# Altium project led_7seg_big.PrjPcb
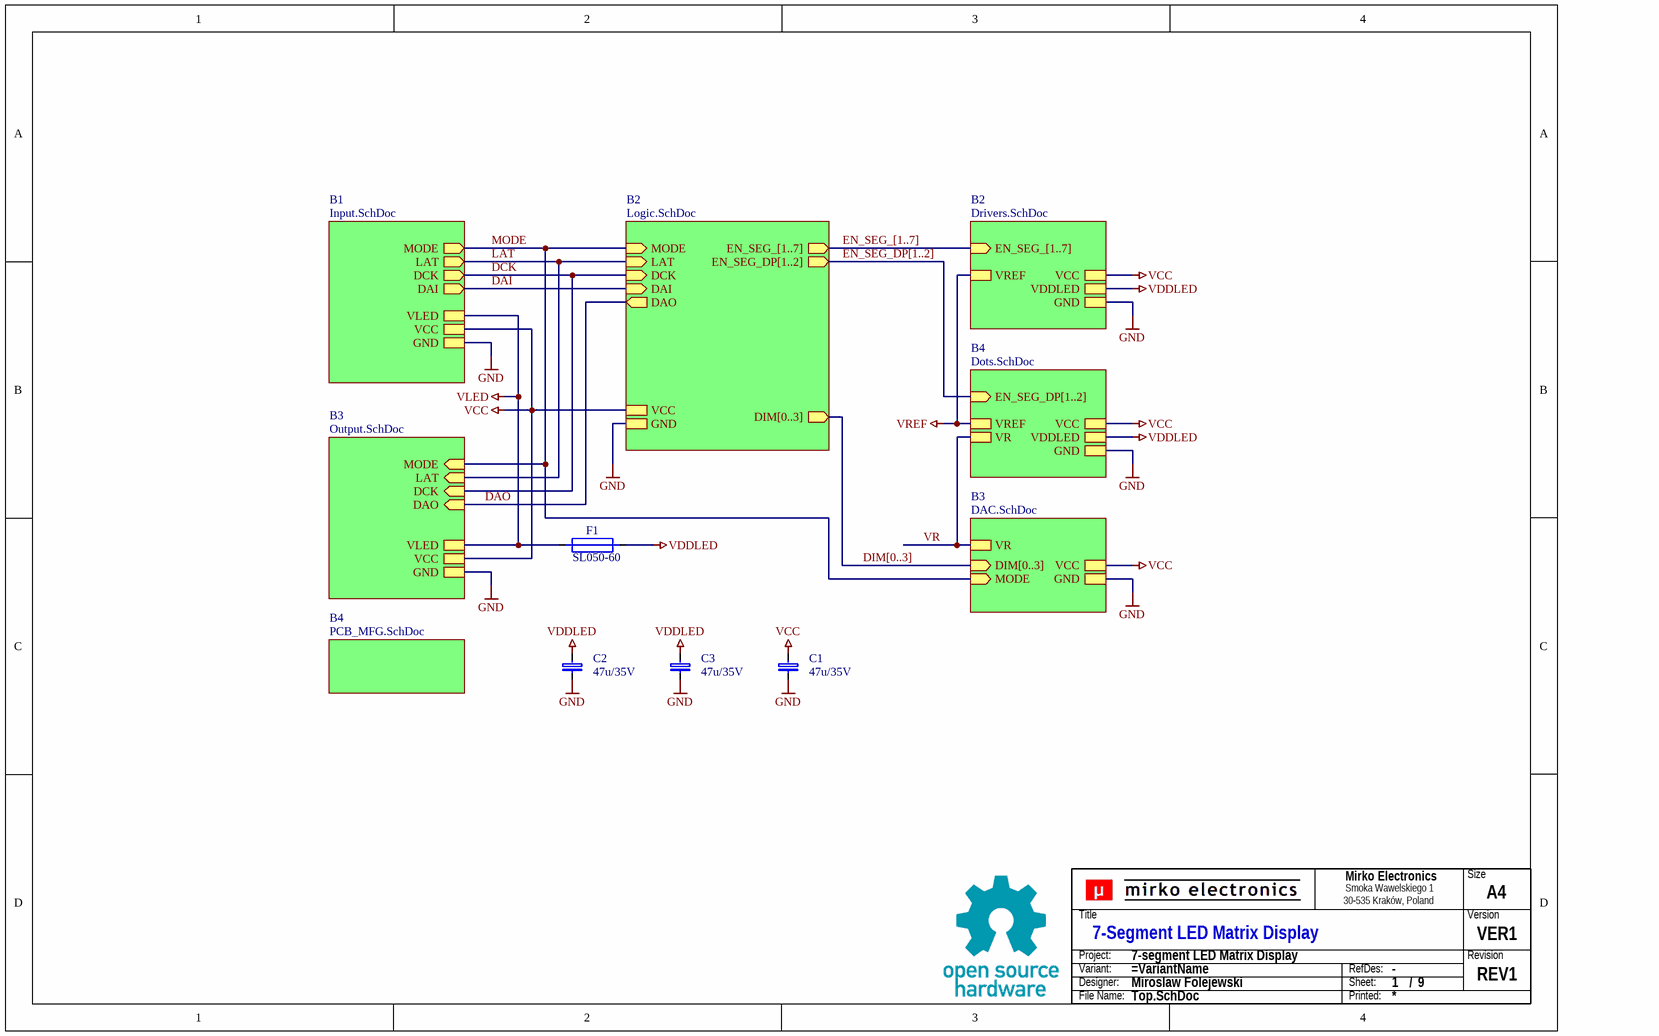
[diagram p0: Top.SchDoc]
PCBProjectName: 7-segment LED Matrix Display; SchPcbRevision: REV1; SchPcbVersion: VER1
9 sheets, 236 parts. Net scope: hierarchical (ports join the sheet entries above them; power ports are global).
Board files: led_7seg_big.PcbDoc, construction.PcbDoc
Sheets:
  Top.SchDoc
    B1 = Input.SchDoc
    B2 = Logic.SchDoc
    B3 = Output.SchDoc
    B4 = PCB_MFG.SchDoc
    B2 = Drivers.SchDoc
      seg1 = Row.SchDoc
      seg2 = Row.SchDoc
      seg3 = Row.SchDoc
      seg4 = Row.SchDoc
      seg5 = Row.SchDoc
      seg6 = Row.SchDoc
      seg7 = Row.SchDoc
    B3 = DAC.SchDoc
    B4 = Dots.SchDoc
      seg9 = Row.SchDoc

## Sheet Top.SchDoc: 7-Segment LED Matrix Display
size A4; Address1: Smoka Wawelskiego 1; Address2: 30-535 Kraków, Poland; DocumentNumber: 1; Revision: v01; SheetNumber: 1; SheetTotal: 9; Author: Miroslaw Folejewski; CompanyName: Mirko Electronics; DrawnBy: Miroslaw Folejewski; Engineer: Miroslaw Folejewski; PageSetup: Record=PageOptions|CenterHorizontal=True|CenterVertical=True|PrintScale=1.00|XCorrection=1.00|YCorrection=1.00|PrintKind=0|BorderSize=5000000|LeftOffset=0|BottomOffset=0|Orientation=2|PaperLength=1000|PaperWidth=1000|Scale=100|PaperSource=7|PrintQuality=-4|MediaType=1|DitherType=10|PaperKind=A4|PrintScaleMode=1; PageSize: A4; Designators: -; ProjectName: 7-Segment LED Matrix Display

### Parts
(Parts that share a designator on the sheet are numbered #1, #2 ... from top to bottom, then left to right.)
?#1  (no value)  (graphical)
C1  47u/35V  [CAP_V_6.3X11]
C2  47u/35V  [CAP_V_6.3X11]
C3  47u/35V  [CAP_V_6.3X11]
F1  SL050-60  [2920]
TB?#1  Title block  (value not drawn)  (graphical)

### Sub-sheets
B1 = Input.SchDoc: MODE (out), LAT (out), DCK (out), DAI (out), VCC, VLED, GND
B2 = Logic.SchDoc: MODE (in), LAT (in), DCK (in), DAI (in), VCC, GND, DAO (out), EN_SEG_[1..7] (out), EN_SEG_DP[1..2] (out), DIM[0..3] (out)
B2 = Drivers.SchDoc: EN_SEG_[1..7] (in), VCC, VDDLED, GND, VREF
B3 = Output.SchDoc: MODE (in), LAT (in), DCK (in), VCC, VLED, GND, DAO (in)
B3 = DAC.SchDoc: DIM[0..3] (in), VCC, MODE (in), GND, VR
B4 = PCB_MFG.SchDoc: no entries
B4 = Dots.SchDoc: EN_SEG_DP[1..2] (in), VCC, VDDLED, GND, VREF, VR

### Nets
GND: C1.1 C2.1 C3.1 ; sheet B1/GND, sheet B2/GND, sheet B3/GND, sheet B2/GND, sheet B3/GND, sheet B4/GND
VCC: C1.2 ; sheet B1/VCC, sheet B2/VCC, sheet B3/VCC, sheet B2/VCC, sheet B3/VCC, sheet B4/VCC
VDDLED: C2.2 C3.2 F1.1 ; sheet B2/VDDLED, sheet B4/VDDLED
VLED: F1.2 ; sheet B1/VLED, sheet B3/VLED
VREF: sheet B2/VREF, sheet B4/VREF
DAI: sheet B1/DAI, sheet B2/DAI
DAO: sheet B2/DAO, sheet B3/DAO
DCK: sheet B1/DCK, sheet B2/DCK, sheet B3/DCK
LAT: sheet B1/LAT, sheet B2/LAT, sheet B3/LAT
MODE: sheet B1/MODE, sheet B2/MODE, sheet B3/MODE, sheet B3/MODE
VR: sheet B3/VR, sheet B4/VR

### Buses and harness runs
bus DIM[0..3] = sheet B2/DIM[0..3] = sheet B3/DIM[0..3]
bus EN_SEG_[1..7] = sheet B2/EN_SEG_[1..7]
bus EN_SEG_DP[1..2] = sheet B2/EN_SEG_DP[1..2] = sheet B4/EN_SEG_DP[1..2]

### Notes on the sheet
- Title
- Size
- Revision
- Checked By:
- Project:
- Variant:
- Engineer:
- Date:
- Sheet:
- /
- Designators
- Approved By:
- File:
- (in symbol SCH_TITLE_BLOCK_V1) Size; Title; Version; Project:; Revision; Variant:; RefDes:; Designer:; Sheet:; /; File Name:; Printed:

### Library data of the parts
?#1 = Title Block NeoStrain
C1-C3 = CAP_EL_SMD: Kondensator elektrolityczny 2.5x6.3x11
F1 = FUSE
TB?#1 = SCH_TITLE_BLOCK_V1: Component Type: Title block; Manufacturer: -; Mounting Type: Non component; MPN: -; Operating Temperature: -; Package: -; Specification: Title block; Value: Title block; Replacement: -; System: ?

## Sheet Input.SchDoc: Input
size A4; Address1: Smoka Wawelskiego 1; Address2: 30-535 Kraków, Poland; DocumentNumber: 2; Revision: v01; SheetNumber: 2; SheetTotal: 9; Author: Miroslaw Folejewski; CompanyName: Mirko Electronics; DrawnBy: Miroslaw Folejewski; Engineer: Miroslaw Folejewski; PageSetup: Record=PageOptions|CenterHorizontal=True|CenterVertical=True|PrintScale=1.00|XCorrection=1.00|YCorrection=1.00|PrintKind=0|BorderSize=5000000|LeftOffset=0|BottomOffset=0|Orientation=2|PaperLength=1000|PaperWidth=1000|Scale=100|PaperSource=7|PrintQuality=-4|MediaType=1|DitherType=10|PaperKind=A4|PrintScaleMode=1; PageSize: A4; Designators: -; ProjectName: 7-Segment LED Matrix Display
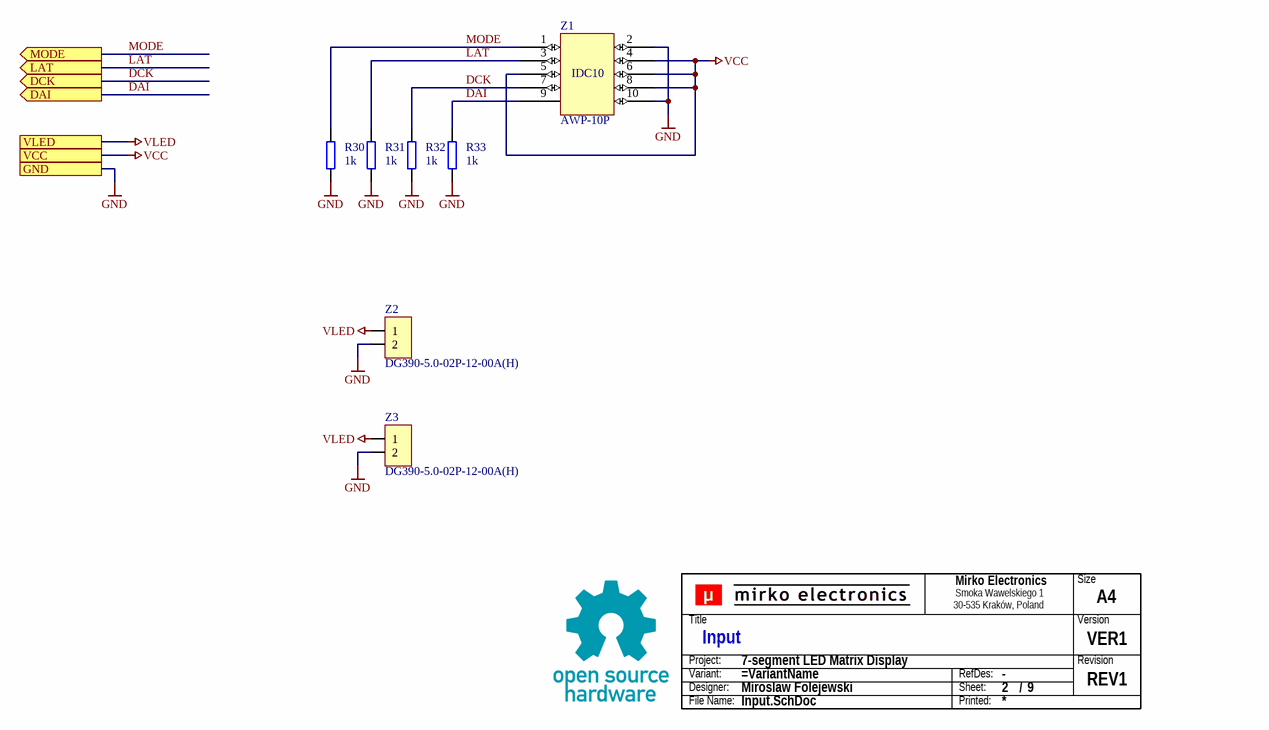
[diagram p1: Input.SchDoc]

### Parts
(Parts that share a designator on the sheet are numbered #1, #2 ... from top to bottom, then left to right.)
?#2  (no value)  (graphical)
R30  1k  [0805]
R31  1k  [0805]
R32  1k  [0805]
R33  1k  [0805]
TB?#2  Title block  (value not drawn)  (graphical)
Z1  AWP-10P  [BH10S]
Z2  DG390-5.0-02P-12-00A(H)  [WAGO2X2-5]
Z3  DG390-5.0-02P-12-00A(H)  [WAGO2X2-5]

### Ports
DAI (out), DCK (out), GND, LAT (out), MODE (out), VCC, VLED

### Nets
GND: R30.1 R31.1 R32.1 R33.1 Z1.2 Z1.10 Z2.2 Z3.2 ; port GND
VCC: Z1.4 Z1.5 Z1.6 Z1.8 ; port VCC
VLED: Z2.1 Z3.1 ; port VLED
DAI: R33.2 Z1.9 ; port DAI
DCK: R32.2 Z1.7 ; port DCK
LAT: R31.2 Z1.3 ; port LAT
MODE: R30.2 Z1.1 ; port MODE

### Notes on the sheet
- Title
- Size
- Revision
- Checked By:
- Project:
- Variant:
- Engineer:
- Date:
- Sheet:
- /
- Designators
- Approved By:
- File:
- (in symbol SCH_TITLE_BLOCK_V1) Size; Title; Version; Project:; Revision; Variant:; RefDes:; Designer:; Sheet:; /; File Name:; Printed:

### Library data of the parts
?#2 = Title Block NeoStrain
R30-R33 = R0805
TB?#2 = SCH_TITLE_BLOCK_V1: Component Type: Title block; Manufacturer: -; Mounting Type: Non component; MPN: -; Operating Temperature: -; Package: -; Specification: Title block; Value: Title block; Replacement: -; System: ?
Z1 = IDC10
Z2 Z3 = CON2: Connector

## Sheet Logic.SchDoc: 16-bit Register
size A4; Address1: Smoka Wawelskiego 1; Address2: 30-535 Kraków, Poland; DocumentNumber: 4; Revision: v01; SheetNumber: 4; SheetTotal: 9; Author: Miroslaw Folejewski; CompanyName: Mirko Electronics; DrawnBy: Miroslaw Folejewski; Engineer: Miroslaw Folejewski; PageSetup: Record=PageOptions|CenterHorizontal=True|CenterVertical=True|PrintScale=1.00|XCorrection=1.00|YCorrection=1.00|PrintKind=0|BorderSize=5000000|LeftOffset=0|BottomOffset=0|Orientation=2|PaperLength=1000|PaperWidth=1000|Scale=100|PaperSource=7|PrintQuality=-4|MediaType=1|DitherType=10|PaperKind=A4|PrintScaleMode=1; PageSize: A4; Designators: -; ProjectName: 7-Segment LED Matrix Display
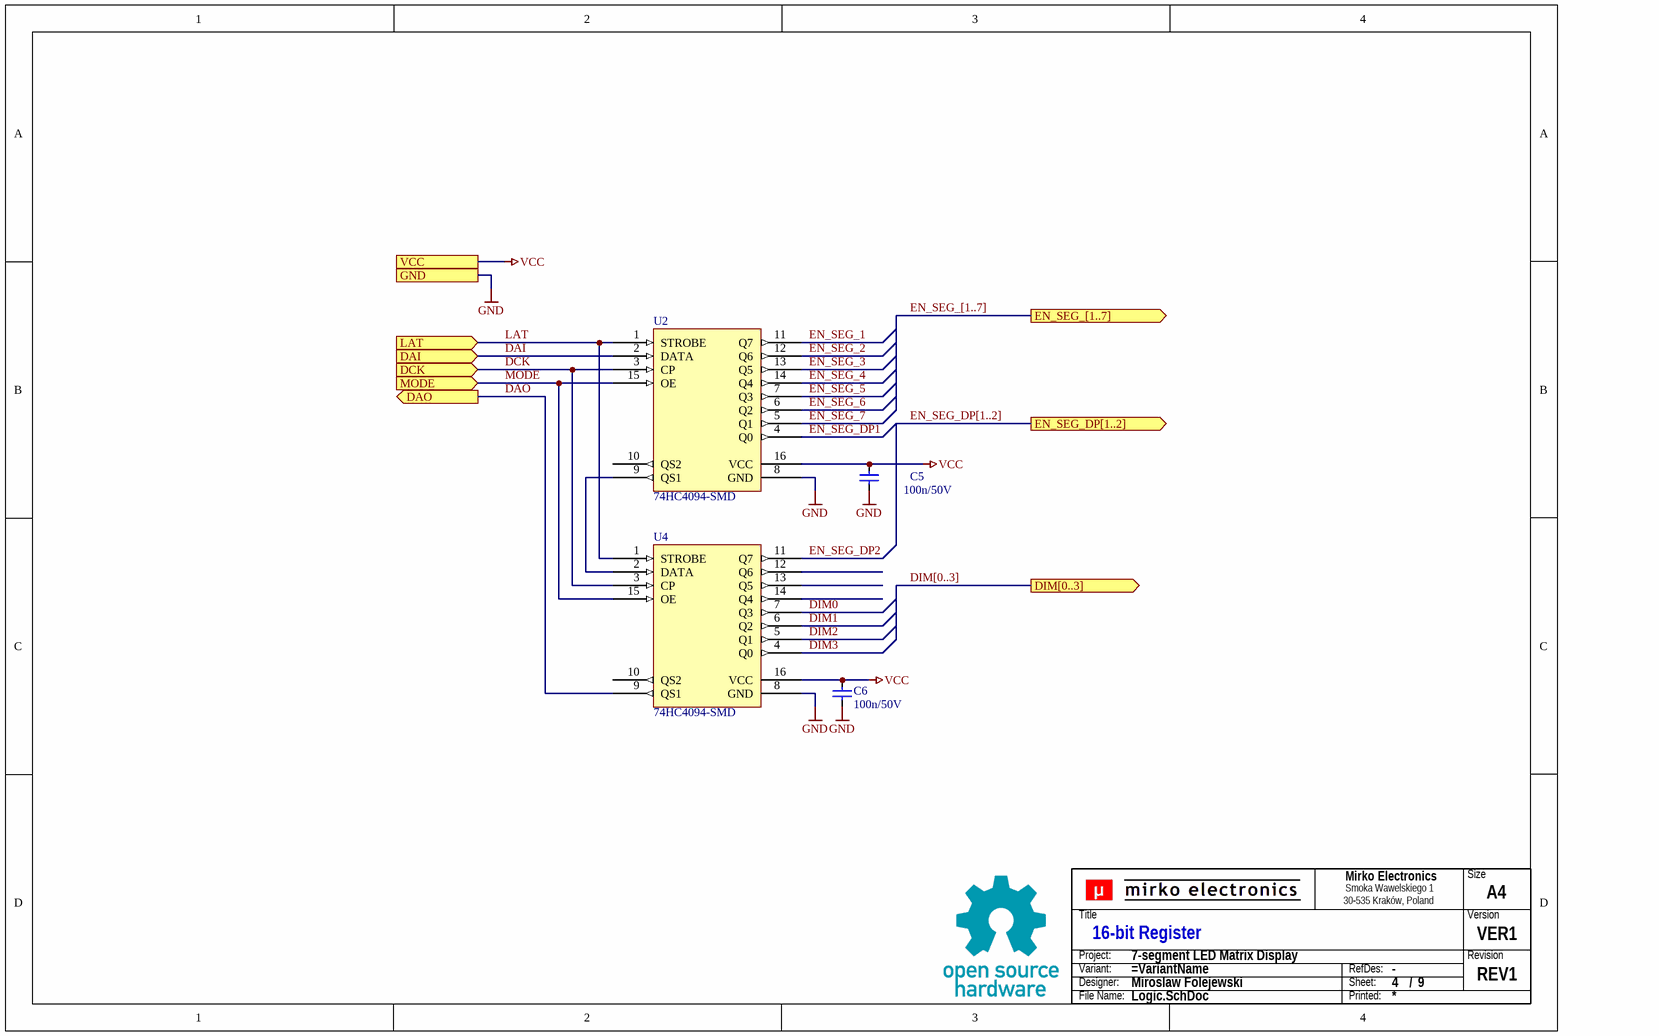
[diagram p2: Logic.SchDoc]

### Parts
(Parts that share a designator on the sheet are numbered #1, #2 ... from top to bottom, then left to right.)
?#3  (no value)  (graphical)
C5  100n/50V  [0805]
C6  100n/50V  [0805]
TB?#3  Title block  (value not drawn)  (graphical)
U2  74HC4094-SMD  [SO16N]
U4  74HC4094-SMD  [SO16N]

### Ports
DAI (in), DAO (out), DCK (in), DIM[0..3] (out), EN_SEG_[1..7] (out), EN_SEG_DP[1..2] (out), GND, LAT (in), MODE (in), VCC

### Nets
GND: C5.2 C6.2 U2.8(GND) U4.8(GND) ; port GND
VCC: C5.1 C6.1 U2.16(VCC) U4.16(VCC) ; port VCC
DAI: U2.2(DATA) ; port DAI
DAO: U4.9(QS1) ; port DAO
DCK: U2.3(CP) U4.3(CP) ; port DCK
DIM0: U4.7(Q3)
DIM1: U4.6(Q2)
DIM2: U4.5(Q1)
DIM3: U4.4(Q0)
EN_SEG_1: U2.11(Q7)
EN_SEG_2: U2.12(Q6)
EN_SEG_3: U2.13(Q5)
EN_SEG_4: U2.14(Q4)
EN_SEG_5: U2.7(Q3)
EN_SEG_6: U2.6(Q2)
EN_SEG_7: U2.5(Q1)
EN_SEG_DP1: U2.4(Q0)
EN_SEG_DP2: U4.11(Q7)
LAT: U2.1(STROBE) U4.1(STROBE) ; port LAT
MODE: U2.15(OE) U4.15(OE) ; port MODE
NetU2_9: U2.9(QS1) U4.2(DATA)

Not connected (* = marked no-connect by the designer): U2 10(QS2); U4 10(QS2) 12(Q6) 13(Q5) 14(Q4)

### Buses and harness runs
bus DIM[0..3] = port DIM[0..3]
bus EN_SEG_[1..7] = port EN_SEG_[1..7]
bus EN_SEG_DP[1..2] = port EN_SEG_DP[1..2]

### Notes on the sheet
- Title
- Size
- Revision
- Checked By:
- Project:
- Variant:
- Engineer:
- Date:
- Sheet:
- /
- Designators
- Approved By:
- File:
- (in symbol SCH_TITLE_BLOCK_V1) Size; Title; Version; Project:; Revision; Variant:; RefDes:; Designer:; Sheet:; /; File Name:; Printed:

### Library data of the parts
?#3 = Title Block NeoStrain
C5 C6 = CAP
TB?#3 = SCH_TITLE_BLOCK_V1: Component Type: Title block; Manufacturer: -; Mounting Type: Non component; MPN: -; Operating Temperature: -; Package: -; Specification: Title block; Value: Title block; Replacement: -; System: ?
U2 U4 = 74HC4094

## Sheet Output.SchDoc: Output
size A4; Address1: Smoka Wawelskiego 1; Address2: 30-535 Kraków, Poland; DocumentNumber: 3; Revision: v01; SheetNumber: 3; SheetTotal: 9; Author: Miroslaw Folejewski; CompanyName: Mirko Electronics; DrawnBy: Miroslaw Folejewski; Engineer: Miroslaw Folejewski; PageSetup: Record=PageOptions|CenterHorizontal=True|CenterVertical=True|PrintScale=1.00|XCorrection=1.00|YCorrection=1.00|PrintKind=0|BorderSize=5000000|LeftOffset=0|BottomOffset=0|Orientation=2|PaperLength=1000|PaperWidth=1000|Scale=100|PaperSource=7|PrintQuality=-4|MediaType=1|DitherType=10|PaperKind=A4|PrintScaleMode=1; PageSize: A4; Designators: -; ProjectName: 7-Segment LED Matrix Display
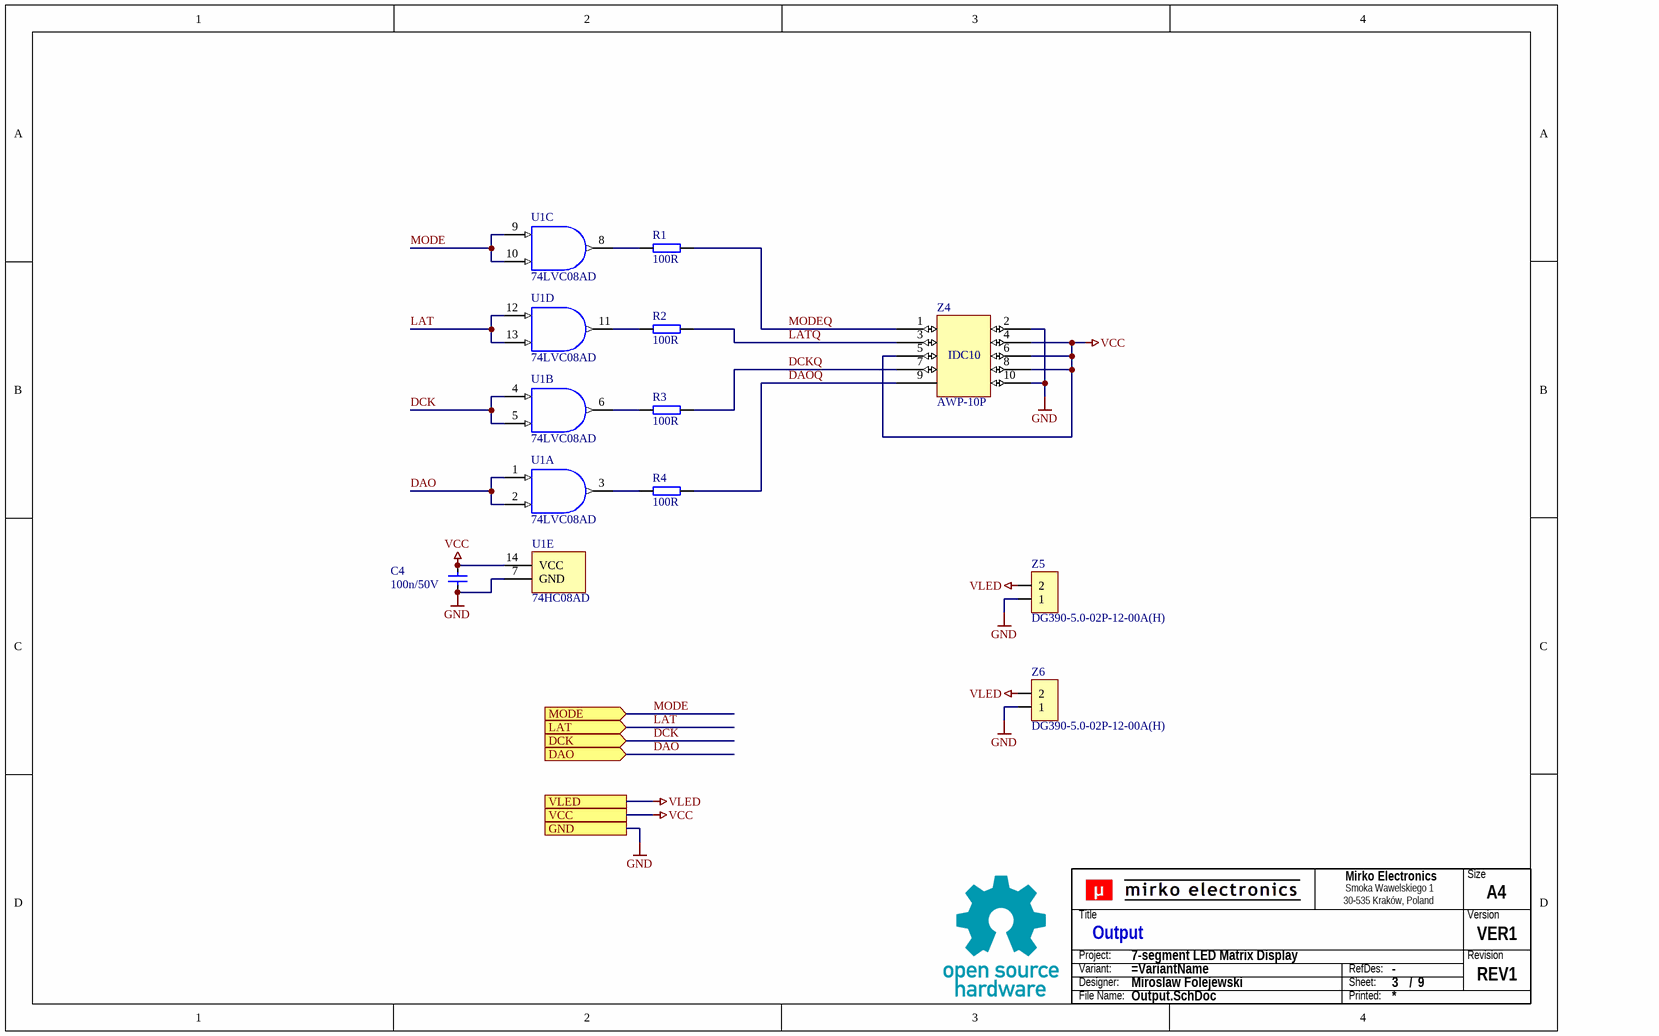
[diagram p3: Output.SchDoc]

### Parts
(Parts that share a designator on the sheet are numbered #1, #2 ... from top to bottom, then left to right.)
?#4  (no value)  (graphical)
C4  100n/50V  [0805]
R1  100R  [0805]
R2  100R  [0805]
R3  100R  [0805]
R4  100R  [0805]
TB?#4  Title block  (value not drawn)  (graphical)
U1  74LVC08AD  [SO14]  (parts A,B,C,D,E of 5)
Z4  AWP-10P  [BH10S]
Z5  DG390-5.0-02P-12-00A(H)  [WAGO2X2-5]
Z6  DG390-5.0-02P-12-00A(H)  [WAGO2X2-5]

### Ports
DAO (in), DCK (in), GND, LAT (in), MODE (in), VCC, VLED

### Nets
GND: C4.2 U1.7(GND) Z4.2 Z4.10 Z5.1 Z6.1 ; port GND
VCC: C4.1 U1.14(VCC) Z4.4 Z4.5 Z4.6 Z4.8 ; port VCC
VLED: Z5.2 Z6.2 ; port VLED
DAO: U1.1(A) U1.2(B) ; port DAO
DAOQ: R4.2 Z4.9
DCK: U1.4(A) U1.5(B) ; port DCK
DCKQ: R3.2 Z4.7
LAT: U1.12(A) U1.13(B) ; port LAT
LATQ: R2.2 Z4.3
MODE: U1.9(A) U1.10(B) ; port MODE
MODEQ: R1.2 Z4.1
NetR1_1: R1.1 U1.8(Y)
NetR2_1: R2.1 U1.11(Y)
NetR3_1: R3.1 U1.6(Y)
NetR4_1: R4.1 U1.3(Y)

### Notes on the sheet
- Title
- Size
- Revision
- Checked By:
- Project:
- Variant:
- Engineer:
- Date:
- Sheet:
- /
- Designators
- Approved By:
- File:
- (in symbol SCH_TITLE_BLOCK_V1) Size; Title; Version; Project:; Revision; Variant:; RefDes:; Designer:; Sheet:; /; File Name:; Printed:

### Library data of the parts
?#4 = Title Block NeoStrain
C4 = CAP
R1-R4 = R0805
TB?#4 = SCH_TITLE_BLOCK_V1: Component Type: Title block; Manufacturer: -; Mounting Type: Non component; MPN: -; Operating Temperature: -; Package: -; Specification: Title block; Value: Title block; Replacement: -; System: ?
U1 = 74AC08: Quadruple 2-Input Positive-AND Gate
Z4 = IDC10
Z5 Z6 = CON2: Connector

## Sheet PCB_MFG.SchDoc: PCB Manufacturing
size A4; Address1: Smoka Wawelskiego 1; Address2: 30-535 Kraków, Poland; DocumentNumber: 9; Revision: v01; SheetNumber: 9; SheetTotal: 9; Author: Miroslaw Folejewski; CompanyName: Mirko Electronics; DrawnBy: Miroslaw Folejewski; Engineer: Miroslaw Folejewski; PageSetup: Record=PageOptions|CenterHorizontal=True|CenterVertical=True|PrintScale=1.00|XCorrection=1.00|YCorrection=1.00|PrintKind=0|BorderSize=5000000|LeftOffset=0|BottomOffset=0|Orientation=2|PaperLength=1000|PaperWidth=1000|Scale=100|PaperSource=7|PrintQuality=-4|MediaType=1|DitherType=10|PaperKind=A4|PrintScaleMode=1; PageSize: A4; Designators: -; ProjectName: 7-Segment LED Matrix Display
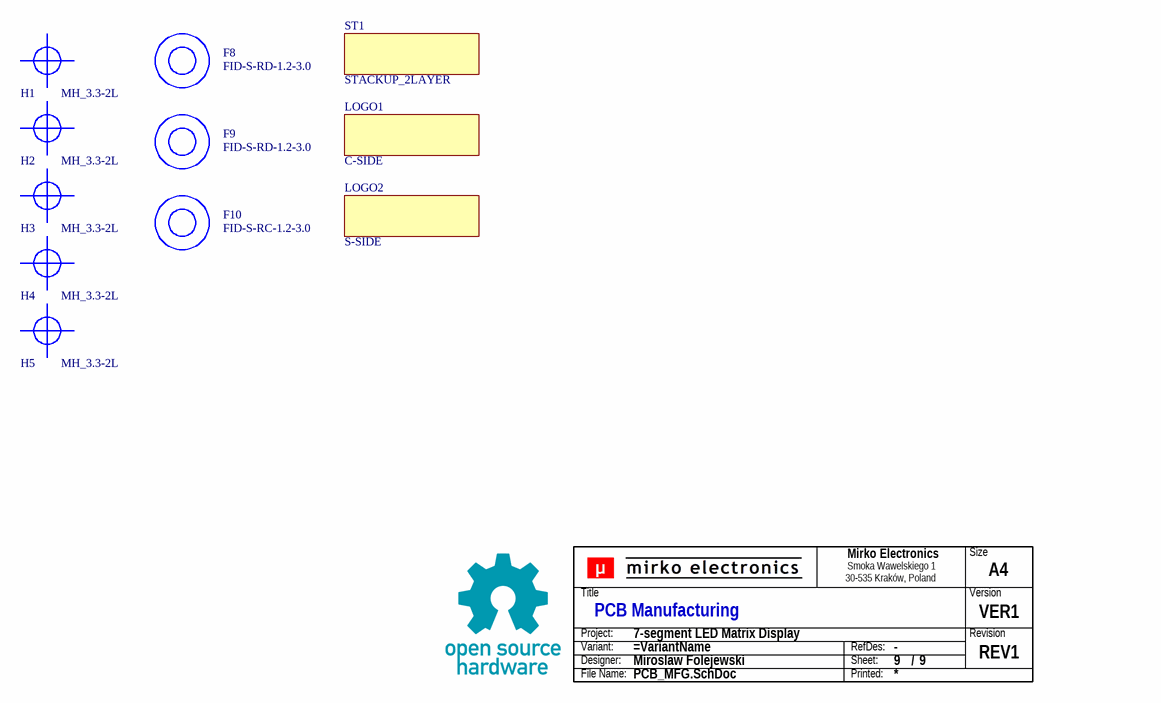
[diagram p4: PCB_MFG.SchDoc]

### Parts
(Parts that share a designator on the sheet are numbered #1, #2 ... from top to bottom, then left to right.)
?#5  (no value)  (graphical)
F8  FID-S-RD-1.2-3.0  [FID-S-RD-1.2-3.0]
F9  FID-S-RD-1.2-3.0  [FID-S-RD-1.2-3.0]
F10  FID-S-RC-1.2-3.0  [FID-S-RC-1.2-3.0]
H1  MH_3.3-2L  [MH_3.3-2L]
H2  MH_3.3-2L  [MH_3.3-2L]
H3  MH_3.3-2L  [MH_3.3-2L]
H4  MH_3.3-2L  [MH_3.3-2L]
H5  MH_3.3-2L  [MH_3.3-2L]
LOGO1  C-SIDE  [COMPONENT_SIDE]
LOGO2  S-SIDE  [SOLDER_SIDE]
ST1  STACKUP_2LAYER  [STACKUP_2LAYER]
TB?#5  Title block  (value not drawn)  (graphical)

### Notes on the sheet
- Title
- Size
- Revision
- Checked By:
- Project:
- Variant:
- Engineer:
- Date:
- Sheet:
- /
- Designators
- Approved By:
- File:
- (in symbol SCH_TITLE_BLOCK_V1) Size; Title; Version; Project:; Revision; Variant:; RefDes:; Designer:; Sheet:; /; File Name:; Printed:

### Library data of the parts
?#5 = Title Block NeoStrain
F8-F10 = FLUICIDAL: PCB FLUICIDAL
H1-H5 = MOUNTING_HOLE: Mounting Hole
LOGO1 LOGO2 ST1 = STACKUP_2LAYER: STACKUP 2 LAYER
TB?#5 = SCH_TITLE_BLOCK_V1: Component Type: Title block; Manufacturer: -; Mounting Type: Non component; MPN: -; Operating Temperature: -; Package: -; Specification: Title block; Value: Title block; Replacement: -; System: ?

## Sheet Drivers.SchDoc: 7-Segment Digit
size A4; Address1: Smoka Wawelskiego 1; Address2: 30-535 Kraków, Poland; DocumentNumber: 6; Revision: v01; SheetNumber: 6; SheetTotal: 9; Author: Miroslaw Folejewski; CompanyName: Mirko Electronics; DrawnBy: Miroslaw Folejewski; Engineer: Miroslaw Folejewski; PageSetup: Record=PageOptions|CenterHorizontal=True|CenterVertical=True|PrintScale=1.00|XCorrection=1.00|YCorrection=1.00|PrintKind=0|BorderSize=5000000|LeftOffset=0|BottomOffset=0|Orientation=2|PaperLength=1000|PaperWidth=1000|Scale=100|PaperSource=7|PrintQuality=-4|MediaType=1|DitherType=10|PaperKind=A4|PrintScaleMode=1; PageSize: A4; Designators: -; ProjectName: 7-Segment LED Matrix Display
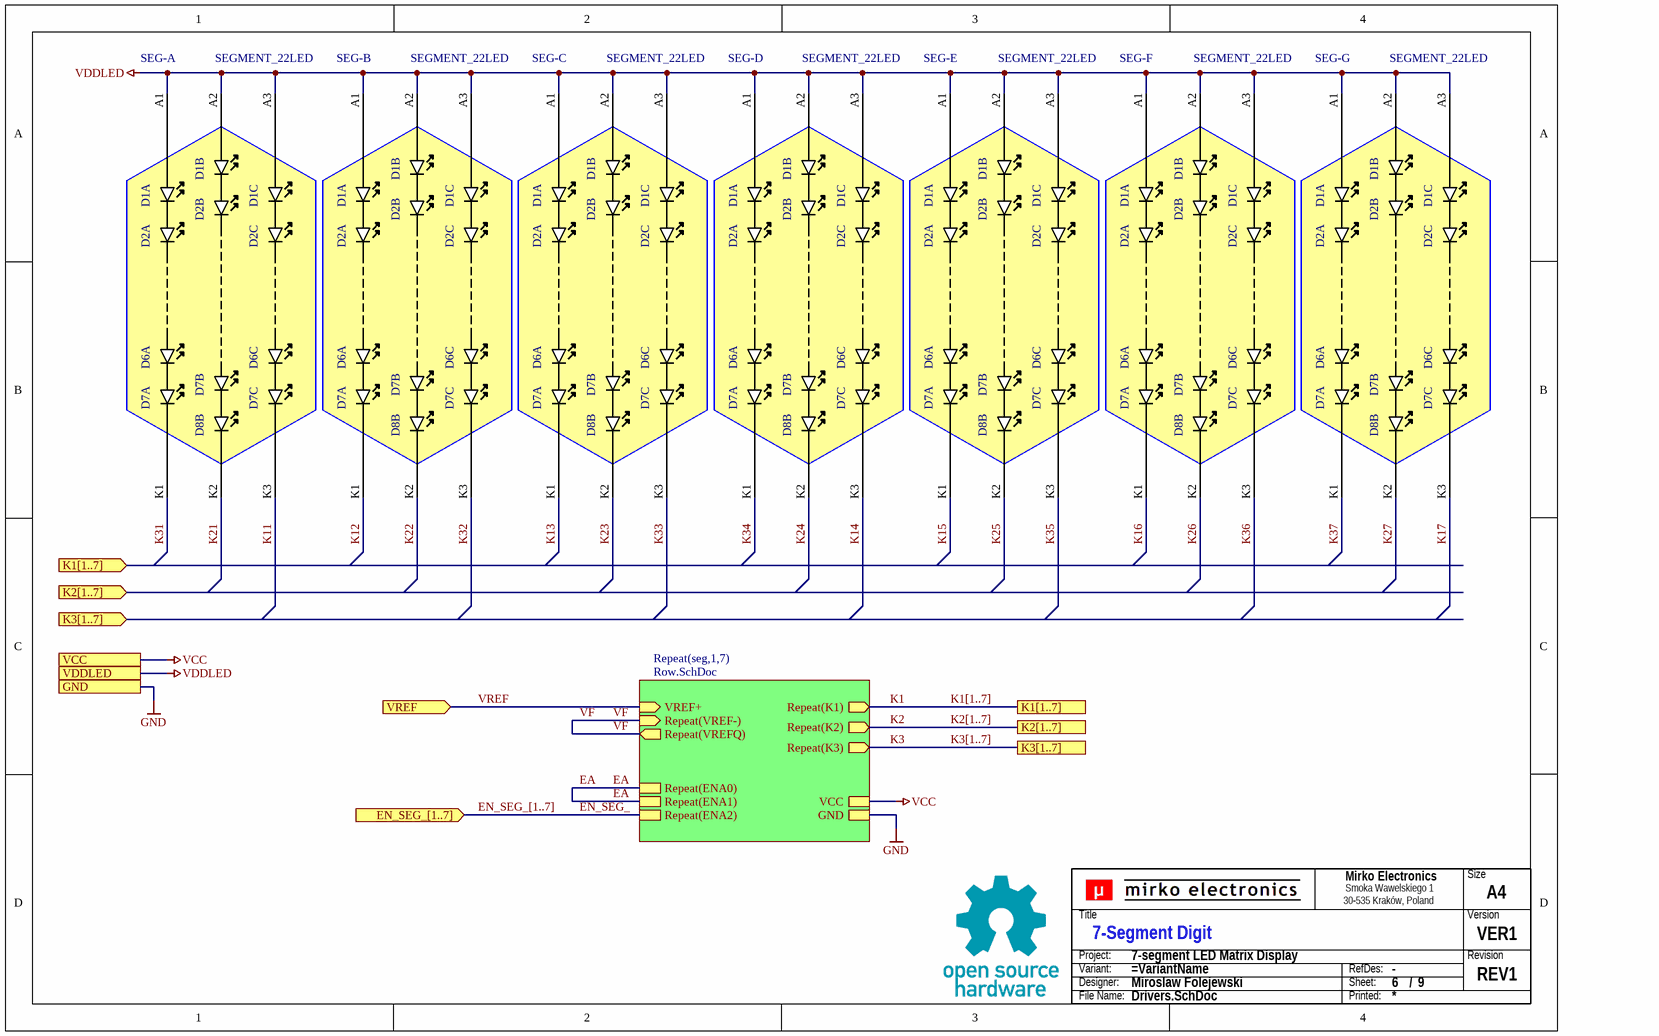
[diagram p5: Drivers.SchDoc]

### Parts
(Parts that share a designator on the sheet are numbered #1, #2 ... from top to bottom, then left to right.)
?#6  (no value)  (graphical)
SEG-A  SEGMENT_22LED  [SEGMENT_22LED_H]
SEG-B  SEGMENT_22LED  [SEGMENT_22LED_V]
SEG-C  SEGMENT_22LED  [SEGMENT_22LED_V]
SEG-D  SEGMENT_22LED  [SEGMENT_22LED_H]
SEG-E  SEGMENT_22LED  [SEGMENT_22LED_V]
SEG-F  SEGMENT_22LED  [SEGMENT_22LED_V]
SEG-G  SEGMENT_22LED  [SEGMENT_22LED_H]
TB?#6  Title block  (value not drawn)  (graphical)

### Sub-sheets
Repeat(seg,1,7) = Row.SchDoc: Repeat(ENA0), VREF+ (in), VCC, GND, Repeat(K1) (out), Repeat(K2) (out), Repeat(K3) (out), Repeat(ENA1), Repeat(ENA2), Repeat(VREF-) (in), Repeat(VREFQ) (out)

### Ports
EN_SEG_[1..7] (in), GND, K1[1..7], K1[1..7] (in), K2[1..7], K2[1..7] (in), K3[1..7], K3[1..7] (in), VCC, VDDLED, VREF (in)

### Nets
GND: port GND, sheet Repeat(seg,1,7)/GND
VCC: port VCC, sheet Repeat(seg,1,7)/VCC
VDDLED: SEG-A.A1(VDD) SEG-A.A2(VDD) SEG-A.A3(VDD) SEG-B.A1(VDD) SEG-B.A2(VDD) SEG-B.A3(VDD) SEG-C.A1(VDD) SEG-C.A2(VDD) SEG-C.A3(VDD) SEG-D.A1(VDD) SEG-D.A2(VDD) SEG-D.A3(VDD) SEG-E.A1(VDD) SEG-E.A2(VDD) SEG-E.A3(VDD) SEG-F.A1(VDD) SEG-F.A2(VDD) SEG-F.A3(VDD) SEG-G.A1(VDD) SEG-G.A2(VDD) SEG-G.A3(VDD) ; port VDDLED
VREF: port VREF, sheet Repeat(seg,1,7)/VREF+
EA: sheet Repeat(seg,1,7)/Repeat(ENA0), sheet Repeat(seg,1,7)/Repeat(ENA1)
EN_SEG_: sheet Repeat(seg,1,7)/Repeat(ENA2)
K1: sheet Repeat(seg,1,7)/Repeat(K1)
K2: sheet Repeat(seg,1,7)/Repeat(K2)
K3: sheet Repeat(seg,1,7)/Repeat(K3)
K11: SEG-A.K3(LED_R)
K12: SEG-B.K1(LED_R)
K13: SEG-C.K1(LED_R)
K14: SEG-D.K3(LED_R)
K15: SEG-E.K1(LED_R)
K16: SEG-F.K1(LED_R)
K17: SEG-G.K3(LED_R)
K21: SEG-A.K2(LED_R)
K22: SEG-B.K2(LED_R)
K23: SEG-C.K2(LED_R)
K24: SEG-D.K2(LED_R)
K25: SEG-E.K2(LED_R)
K26: SEG-F.K2(LED_R)
K27: SEG-G.K2(LED_R)
K31: SEG-A.K1(LED_R)
K32: SEG-B.K3(LED_R)
K33: SEG-C.K3(LED_R)
K34: SEG-D.K1(LED_R)
K35: SEG-E.K3(LED_R)
K36: SEG-F.K3(LED_R)
K37: SEG-G.K1(LED_R)
VF: sheet Repeat(seg,1,7)/Repeat(VREF-), sheet Repeat(seg,1,7)/Repeat(VREFQ)

### Buses and harness runs
bus EA
bus EN_SEG_[1..7] = port EN_SEG_[1..7]
bus K1[1..7] = port K1[1..7]
bus K2[1..7] = port K2[1..7]
bus K3[1..7] = port K3[1..7]
bus VF

### Notes on the sheet
- Title
- Size
- Revision
- Checked By:
- Project:
- Variant:
- Engineer:
- Date:
- Sheet:
- /
- Designators
- Approved By:
- File:
- (in symbol SCH_TITLE_BLOCK_V1) Size; Title; Version; Project:; Revision; Variant:; RefDes:; Designer:; Sheet:; /; File Name:; Printed:
- (in symbol SEGMENT_22LED) D1B; D1A; D1C; D2B; D2A; D2C; D6A; D6C; D7B; D7A; D7C; D8B

### Library data of the parts
?#6 = Title Block NeoStrain
TB?#6 = SCH_TITLE_BLOCK_V1: Component Type: Title block; Manufacturer: -; Mounting Type: Non component; MPN: -; Operating Temperature: -; Package: -; Specification: Title block; Value: Title block; Replacement: -; System: ?

## Sheet Row.SchDoc: Segment Driver
size A4; Address1: Smoka Wawelskiego 1; Address2: 30-535 Kraków, Poland; DocumentNumber: 8; Revision: v01; SheetNumber: 8; SheetTotal: 9; Author: Miroslaw Folejewski; CompanyName: Mirko Electronics; DrawnBy: Miroslaw Folejewski; Engineer: Miroslaw Folejewski; PageSetup: Record=PageOptions|CenterHorizontal=True|CenterVertical=True|PrintScale=1.00|XCorrection=1.00|YCorrection=1.00|PrintKind=0|BorderSize=5000000|LeftOffset=0|BottomOffset=0|Orientation=2|PaperLength=1000|PaperWidth=1000|Scale=100|PaperSource=7|PrintQuality=-4|MediaType=1|DitherType=10|PaperKind=A4|PrintScaleMode=1; PageSize: A4; Designators: -; ProjectName: 7-Segment LED Matrix Display
Used 8 times, as channels B2/seg1, B2/seg2, B2/seg3, B2/seg4, B2/seg5, B2/seg6, B2/seg7, B4/seg9. Parts and nets are listed once, with the designators drawn on the sheet.
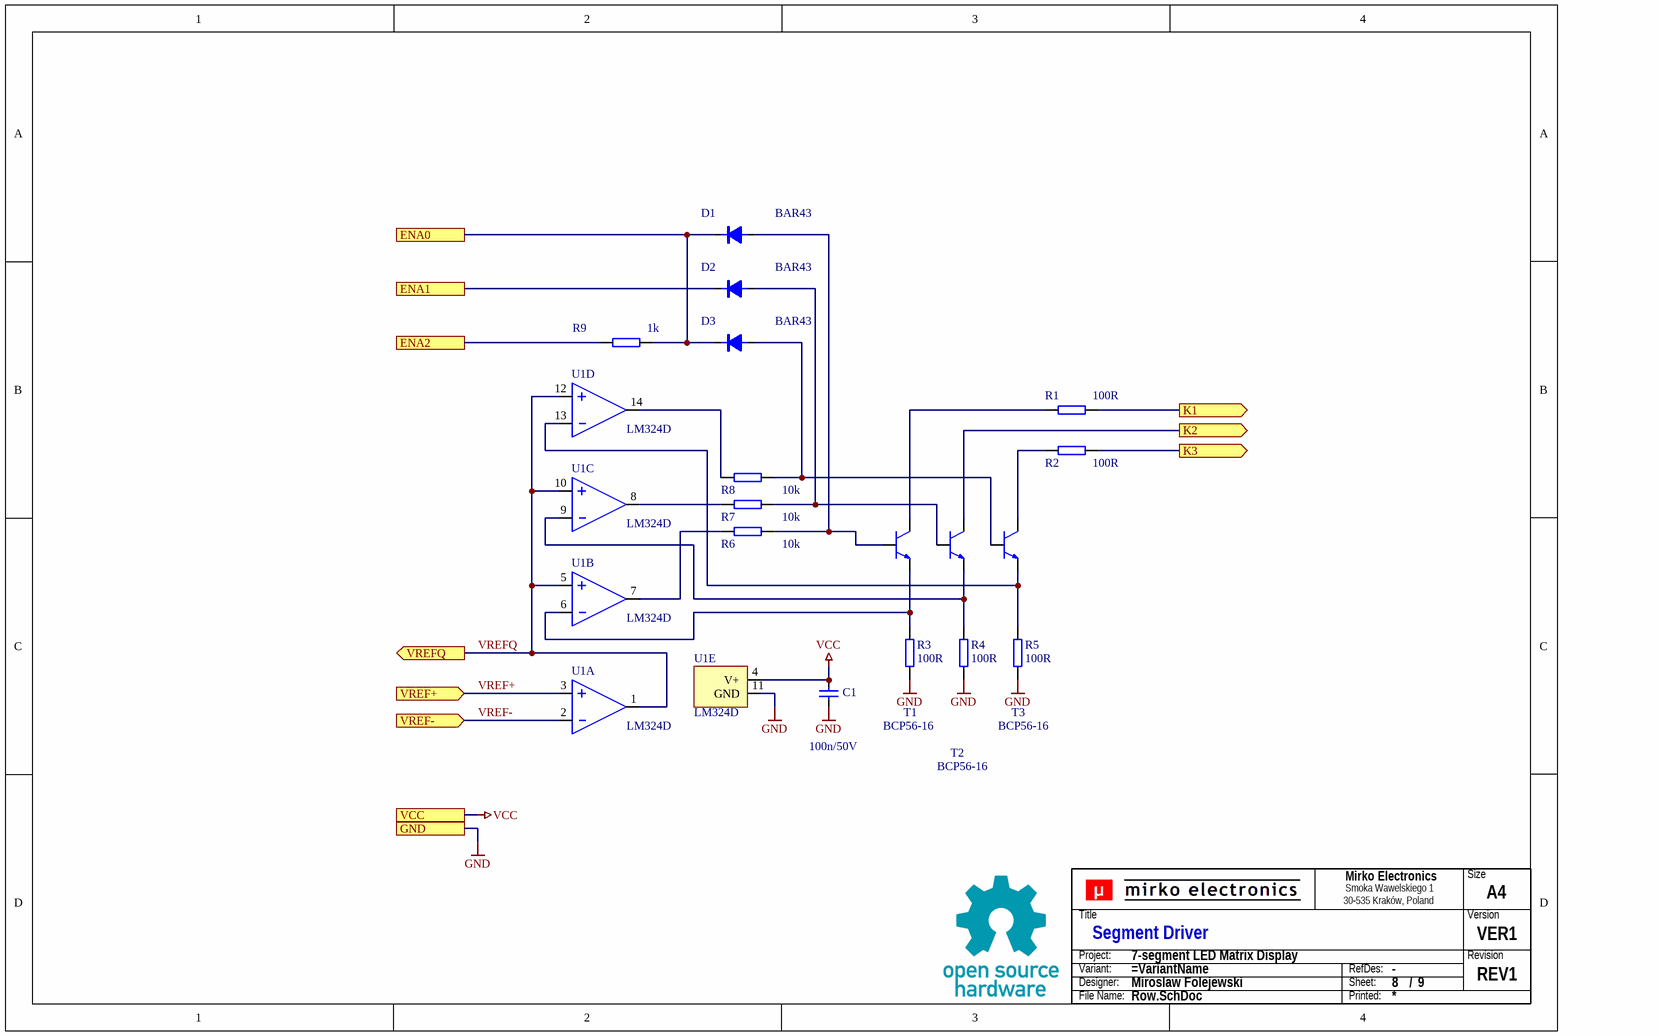
[diagram p6: Row.SchDoc]

### Parts
?  (no value)  (graphical)
C1  100n/50V  [0805]
D1  BAR43  [SOT-23]
D2  BAR43  [SOT-23]
D3  BAR43  [SOT-23]
R1  100R  [1206]
R2  100R  [1206]
R3  100R  [1206]
R4  100R  [1206]
R5  100R  [1206]
R6  10k  [0805]
R7  10k  [0805]
R8  10k  [0805]
R9  1k  [0805]
T1  BCP56-16  [SOT223]
T2  BCP56-16  [SOT223]
T3  BCP56-16  [SOT223]
TB?  Title block  (value not drawn)  (graphical)
U1  LM324D  [SO14]  (parts A,B,C,D,E of 5)

### Ports
ENA0, ENA1, ENA2, GND, K1 (out), K2 (out), K3 (out), VCC, VREF+ (in), VREF- (in), VREFQ (out)

### Nets
GND: C1.2 R3.2 R4.2 R5.2 U1.11(GND) ; port GND
VCC: C1.1 U1.4(V+) ; port VCC
ENA0: D1.3 D3.3 R9.2 ; port ENA0
ENA1: D2.3 ; port ENA1
ENA2: R9.1 ; port ENA2
K1: R1.2 ; port K1
K2: T2.2(C) ; port K2
K3: R2.2 ; port K3
VREF+: U1.3(+) ; port VREF+
VREF-: U1.2(-) ; port VREF-
VREFQ: U1.1(OUT) U1.5(+) U1.10(+) U1.12(+) ; port VREFQ
NetD1_1: D1.1 R6.2 T1.1(B)
NetD2_1: D2.1 R7.2 T2.1(B)
NetD3_1: D3.1 R8.2 T3.1(B)
NetR1_1: R1.1 T1.2(C)
NetR2_1: R2.1 T3.2(C)
NetR3_1: R3.1 T1.3(E) U1.6(-)
NetR4_1: R4.1 T2.3(E) U1.9(-)
NetR5_1: R5.1 T3.3(E) U1.13(-)
NetR6_1: R6.1 U1.7(OUT)
NetR7_1: R7.1 U1.8(OUT)
NetR8_1: R8.1 U1.14(OUT)

### Channels
B2/seg1: designators end in _seg1; ports ENA0=EA1 ENA1=EA1 ENA2=EN_SEG_1 GND=GND K1=K11 K2=K21 K3=K31 VCC=VCC VREF+=VREF VREF-=VF1 VREFQ=VF1
B2/seg2: designators end in _seg2; ports ENA0=EA2 ENA1=EA2 ENA2=EN_SEG_2 GND=GND K1=K12 K2=K22 K3=K32 VCC=VCC VREF+=VREF VREF-=VF2 VREFQ=VF2
B2/seg3: designators end in _seg3; ports ENA0=EA3 ENA1=EA3 ENA2=EN_SEG_3 GND=GND K1=K13 K2=K23 K3=K33 VCC=VCC VREF+=VREF VREF-=VF3 VREFQ=VF3
B2/seg4: designators end in _seg4; ports ENA0=EA4 ENA1=EA4 ENA2=EN_SEG_4 GND=GND K1=K14 K2=K24 K3=K34 VCC=VCC VREF+=VREF VREF-=VF4 VREFQ=VF4
B2/seg5: designators end in _seg5; ports ENA0=EA5 ENA1=EA5 ENA2=EN_SEG_5 GND=GND K1=K15 K2=K25 K3=K35 VCC=VCC VREF+=VREF VREF-=VF5 VREFQ=VF5
B2/seg6: designators end in _seg6; ports ENA0=EA6 ENA1=EA6 ENA2=EN_SEG_6 GND=GND K1=K16 K2=K26 K3=K36 VCC=VCC VREF+=VREF VREF-=VF6 VREFQ=VF6
B2/seg7: designators end in _seg7; ports ENA0=EA7 ENA1=EA7 ENA2=EN_SEG_7 GND=GND K1=K17 K2=K27 K3=K37 VCC=VCC VREF+=VREF VREF-=VF7 VREFQ=VF7
B4/seg9: designators end in _seg9; ports ENA0=NetD1_seg9_3 ENA1=NetD2_seg9_3 ENA2=EN_SEG_DP2 GND=GND K1=NetR1_seg9_2 K2=NetR12_1 K3=NetR2_seg9_2 VCC=VCC VREF+=VR VREF-=VREF- VREFQ=VREF

### Notes on the sheet
- Title
- Size
- Revision
- Checked By:
- Project:
- Variant:
- Engineer:
- Date:
- Sheet:
- /
- Designators
- Approved By:
- File:
- (in symbol SCH_TITLE_BLOCK_V1) Size; Title; Version; Project:; Revision; Variant:; RefDes:; Designer:; Sheet:; /; File Name:; Printed:

### Library data of the parts
? = Title Block NeoStrain
C1 = CAP
R1-R9 = R0805
TB? = SCH_TITLE_BLOCK_V1: Component Type: Title block; Manufacturer: -; Mounting Type: Non component; MPN: -; Operating Temperature: -; Package: -; Specification: Title block; Value: Title block; Replacement: -; System: ?

## Sheet DAC.SchDoc: Digital/Analog Converter
size A4; Address1: Smoka Wawelskiego 1; Address2: 30-535 Kraków, Poland; DocumentNumber: 5; Revision: v01; SheetNumber: 5; SheetTotal: 9; Author: Miroslaw Folejewski; CompanyName: Mirko Electronics; DrawnBy: Miroslaw Folejewski; Engineer: Miroslaw Folejewski; PageSetup: Record=PageOptions|CenterHorizontal=True|CenterVertical=True|PrintScale=1.00|XCorrection=1.00|YCorrection=1.00|PrintKind=0|BorderSize=5000000|LeftOffset=0|BottomOffset=0|Orientation=2|PaperLength=1000|PaperWidth=1000|Scale=100|PaperSource=7|PrintQuality=-4|MediaType=1|DitherType=10|PaperKind=A4|PrintScaleMode=1; PageSize: A4; Designators: -; ProjectName: 7-Segment LED Matrix Display
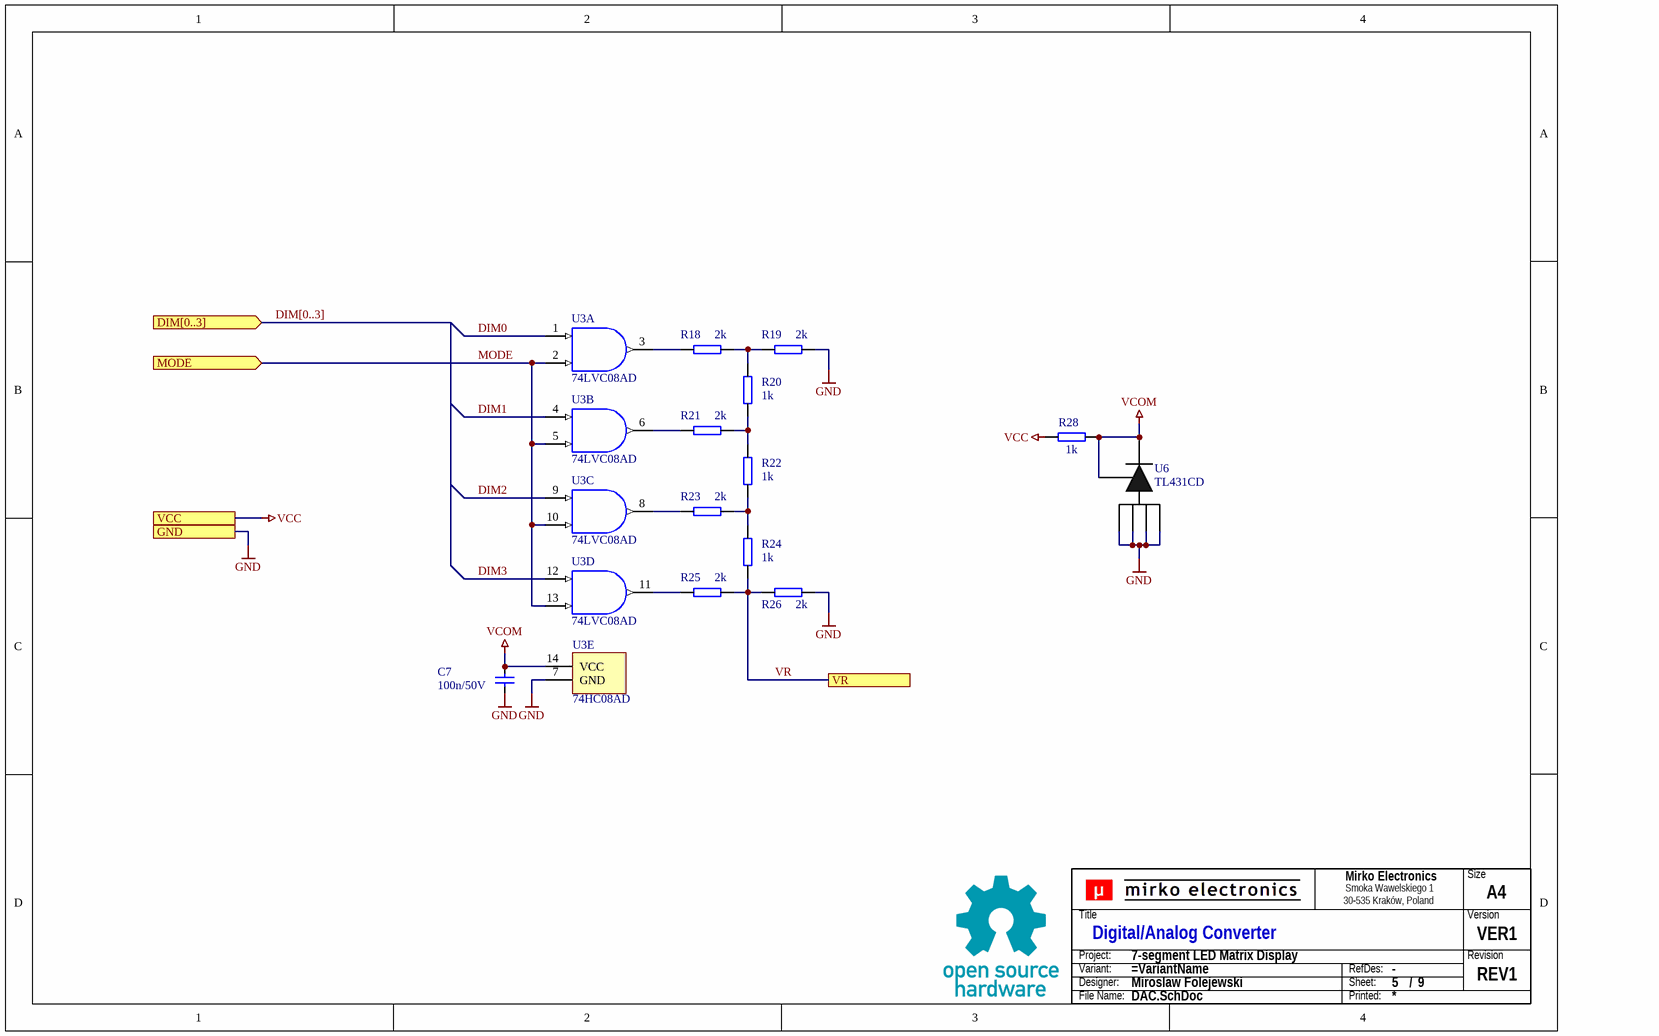
[diagram p7: DAC.SchDoc]

### Parts
(Parts that share a designator on the sheet are numbered #1, #2 ... from top to bottom, then left to right.)
?#7  (no value)  (graphical)
C7  100n/50V  [0805]
R18  2k  [0805]
R19  2k  [0805]
R20  1k  [0805]
R21  2k  [0805]
R22  1k  [0805]
R23  2k  [0805]
R24  1k  [0805]
R25  2k  [0805]
R26  2k  [0805]
R28  1k  [0805]
TB?#7  Title block  (value not drawn)  (graphical)
U3  74LVC08AD  [SO14]  (parts A,B,C,D,E of 5)
U6  TL431CD  [SO8]

### Ports
DIM[0..3] (in), GND, MODE (in), VCC, VR

### Nets
GND: C7.2 R19.2 R26.2 U3.7(GND) U6.2(A) U6.3(A) U6.6(A) U6.7(A) ; port GND
VCC: R28.1 ; port VCC
VCOM: C7.1 R28.2 U3.14(VCC) U6.1(C) U6.8(REF)
DIM0: U3.1(A)
DIM1: U3.4(A)
DIM2: U3.9(A)
DIM3: U3.12(A)
MODE: U3.2(B) U3.5(B) U3.10(B) U3.13(B) ; port MODE
VR: R24.1 R25.2 R26.1 ; port VR
NetR18_1: R18.1 U3.3(Y)
NetR18_2: R18.2 R19.1 R20.2
NetR20_1: R20.1 R21.2 R22.2
NetR21_1: R21.1 U3.6(Y)
NetR22_1: R22.1 R23.2 R24.2
NetR23_1: R23.1 U3.8(Y)
NetR25_1: R25.1 U3.11(Y)

### Buses and harness runs
bus DIM[0..3] = port DIM[0..3]

### Notes on the sheet
- Title
- Size
- Revision
- Checked By:
- Project:
- Variant:
- Engineer:
- Date:
- Sheet:
- /
- Designators
- Approved By:
- File:
- (in symbol SCH_TITLE_BLOCK_V1) Size; Title; Version; Project:; Revision; Variant:; RefDes:; Designer:; Sheet:; /; File Name:; Printed:

### Library data of the parts
?#7 = Title Block NeoStrain
C7 = CAP
R18-R26 R28 = R0805
TB?#7 = SCH_TITLE_BLOCK_V1: Component Type: Title block; Manufacturer: -; Mounting Type: Non component; MPN: -; Operating Temperature: -; Package: -; Specification: Title block; Value: Title block; Replacement: -; System: ?
U3 = 74AC08: Quadruple 2-Input Positive-AND Gate
U6 = TL431CD: REF

## Sheet Dots.SchDoc: Dot Segment
size A4; Address1: Smoka Wawelskiego 1; Address2: 30-535 Kraków, Poland; DocumentNumber: 7; Revision: v01; SheetNumber: 7; SheetTotal: 9; Author: Miroslaw Folejewski; CompanyName: Mirko Electronics; DrawnBy: Miroslaw Folejewski; Engineer: Miroslaw Folejewski; PageSetup: Record=PageOptions|CenterHorizontal=True|CenterVertical=True|PrintScale=1.00|XCorrection=1.00|YCorrection=1.00|PrintKind=0|BorderSize=5000000|LeftOffset=0|BottomOffset=0|Orientation=2|PaperLength=1000|PaperWidth=1000|Scale=100|PaperSource=7|PrintQuality=-4|MediaType=1|DitherType=10|PaperKind=A4|PrintScaleMode=1; PageSize: A4; Designators: -; ProjectName: 7-Segment LED Matrix Display
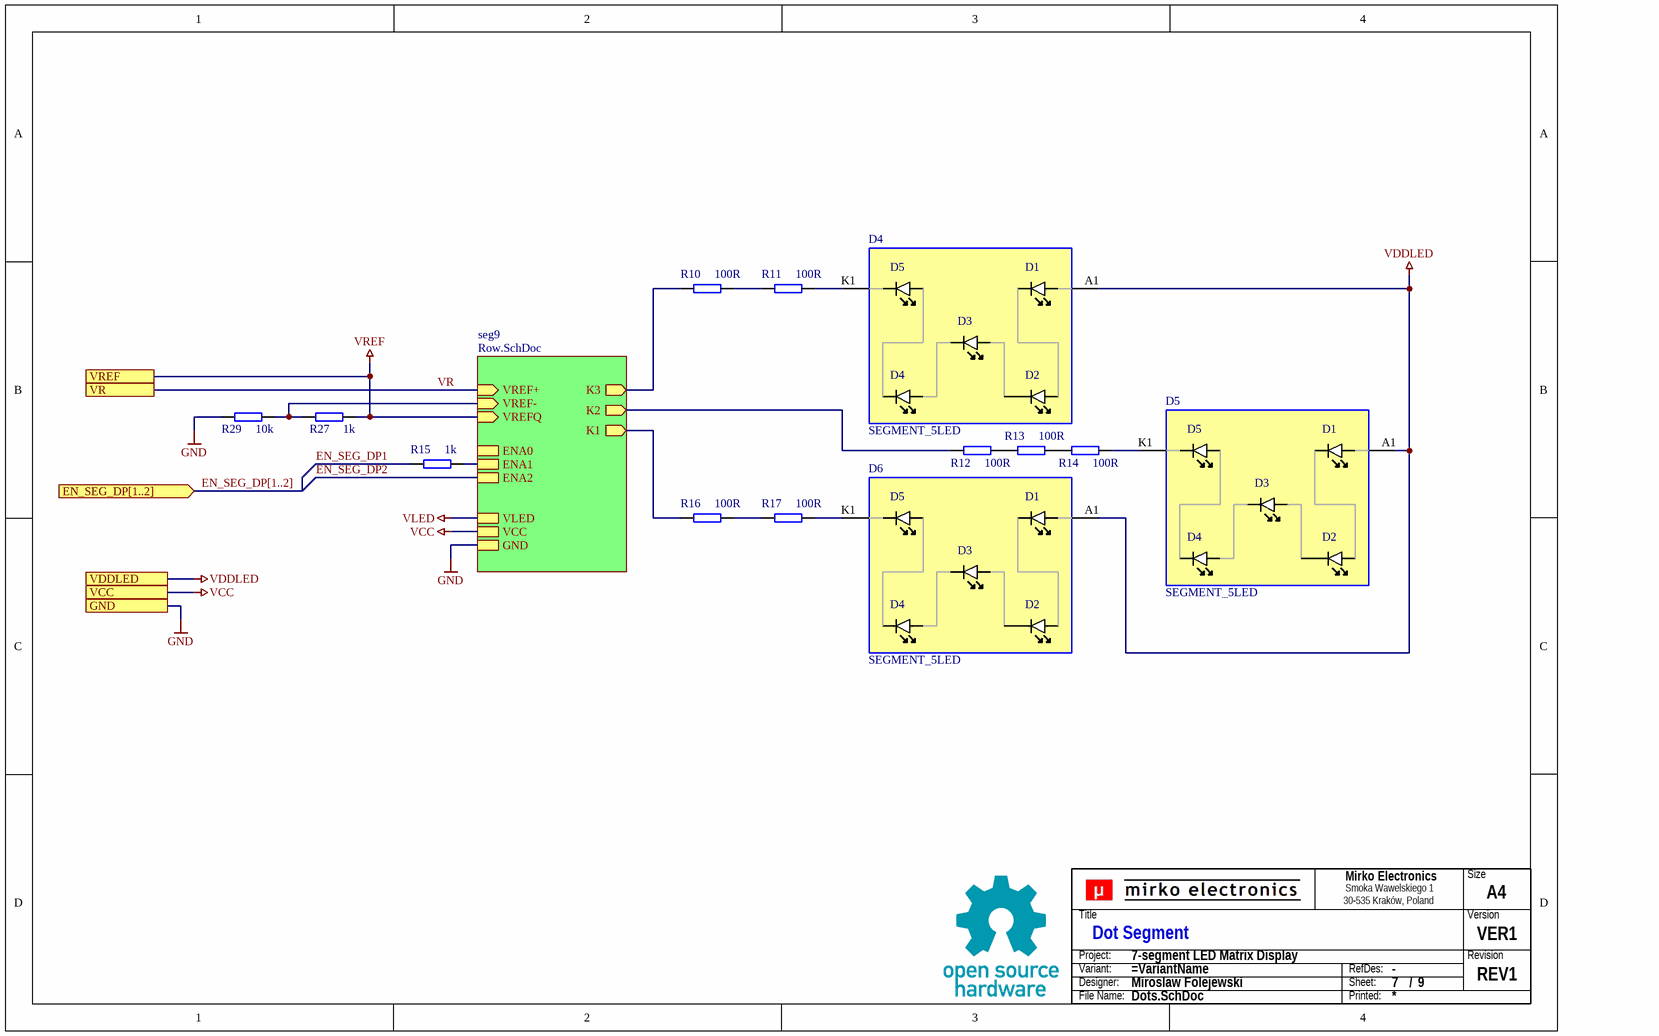
[diagram p8: Dots.SchDoc]

### Parts
(Parts that share a designator on the sheet are numbered #1, #2 ... from top to bottom, then left to right.)
?#8  (no value)  (graphical)
D4  SEGMENT_5LED  [SEGMENT_5LED_V]
D5  SEGMENT_5LED  [SEGMENT_5LED_V]
D6  SEGMENT_5LED  [SEGMENT_5LED_V]
R10  100R  [0805]
R11  100R  [0805]
R12  100R  [0805]
R13  100R  [0805]
R14  100R  [0805]
R15  1k  [0805]
R16  100R  [0805]
R17  100R  [0805]
R27  1k  [0805]
R29  10k  [0805]
TB?#8  Title block  (value not drawn)  (graphical)

### Sub-sheets
seg9 = Row.SchDoc: ENA0, VREF+ (in), VLED, VCC, GND, K1 (out), K2 (out), K3 (out), ENA1, ENA2, VREF- (in), VREFQ (in)

### Ports
EN_SEG_DP[1..2] (in), GND, VCC, VDDLED, VR, VREF

### Nets
GND: R29.1 ; port GND, sheet seg9/GND
VCC: port VCC, sheet seg9/VCC
VDDLED: D4.A1(VDD) D5.A1(VDD) D6.A1(VDD) ; port VDDLED
VREF: R27.2 ; port VREF, sheet seg9/VREFQ
EN_SEG_DP1: R15.1
VR: port VR, sheet seg9/VREF+
VREF-: R27.1 R29.2 ; sheet seg9/VREF-
NetD2_seg9_3: R15.2 ; sheet seg9/ENA1
NetD4_K1: D4.K1(LED_R) R11.2
NetD5_K1: D5.K1(LED_R) R14.2
NetD6_K1: D6.K1(LED_R) R17.2
NetR1_seg9_2: R16.1 ; sheet seg9/K1
NetR2_seg9_2: R10.1 ; sheet seg9/K3
NetR10_2: R10.2 R11.1
NetR12_1: R12.1 ; sheet seg9/K2
NetR12_2: R12.2 R13.1
NetR13_2: R13.2 R14.1
NetR16_2: R16.2 R17.1

### Buses and harness runs
bus EN_SEG_DP[1..2] = port EN_SEG_DP[1..2]

### Notes on the sheet
- Title
- Size
- Revision
- Checked By:
- Project:
- Variant:
- Engineer:
- Date:
- Sheet:
- /
- Designators
- Approved By:
- File:
- (in symbol SCH_TITLE_BLOCK_V1) Size; Title; Version; Project:; Revision; Variant:; RefDes:; Designer:; Sheet:; /; File Name:; Printed:
- (in symbol SEGMENT_5LED) D5; D1; D3; D2; D4

### Library data of the parts
?#8 = Title Block NeoStrain
R10-R17 R27 R29 = R0805
TB?#8 = SCH_TITLE_BLOCK_V1: Component Type: Title block; Manufacturer: -; Mounting Type: Non component; MPN: -; Operating Temperature: -; Package: -; Specification: Title block; Value: Title block; Replacement: -; System: ?

## Nets that join several sheets
GND: Top (C1.1 C2.1 C3.1), Input (8 pins), Logic (C5.2 C6.2 U2.8 U4.8), Output (6 pins), B2/seg1 (5 pins), B2/seg2 (5 pins), B2/seg3 (5 pins), B2/seg4 (5 pins), B2/seg5 (5 pins), B2/seg6 (5 pins), B2/seg7 (5 pins), DAC (8 pins), Dots (R29.1), B4/seg9 (5 pins)
VCC: Top (C1.2), Input (Z1.4 Z1.5 Z1.6 Z1.8), Logic (C5.1 C6.1 U2.16 U4.16), Output (6 pins), B2/seg1 (C1_seg1.1 U1_seg1.4), B2/seg2 (C1_seg2.1 U1_seg2.4), B2/seg3 (C1_seg3.1 U1_seg3.4), B2/seg4 (C1_seg4.1 U1_seg4.4), B2/seg5 (C1_seg5.1 U1_seg5.4), B2/seg6 (C1_seg6.1 U1_seg6.4), B2/seg7 (C1_seg7.1 U1_seg7.4), DAC (R28.1), B4/seg9 (C1_seg9.1 U1_seg9.4)
VDDLED: Top (C2.2 C3.2 F1.1), Drivers (21 pins), Dots (D4.A1 D5.A1 D6.A1)
VLED: Top (F1.2), Input (Z2.1 Z3.1), Output (Z5.2 Z6.2)
VREF: B2/seg1 (U1_seg1.3), B2/seg2 (U1_seg2.3), B2/seg3 (U1_seg3.3), B2/seg4 (U1_seg4.3), B2/seg5 (U1_seg5.3), B2/seg6 (U1_seg6.3), B2/seg7 (U1_seg7.3), Dots (R27.2), B4/seg9 (U1_seg9.1 U1_seg9.5 U1_seg9.10 U1_seg9.12)
DAI: Input (R33.2 Z1.9), Logic (U2.2)
DAO: Logic (U4.9), Output (U1.1 U1.2)
DCK: Input (R32.2 Z1.7), Logic (U2.3 U4.3), Output (U1.4 U1.5)
DIM0: Logic (U4.7), DAC (U3.1)
DIM1: Logic (U4.6), DAC (U3.4)
DIM2: Logic (U4.5), DAC (U3.9)
DIM3: Logic (U4.4), DAC (U3.12)
EN_SEG_1: Logic (U2.11), B2/seg1 (R9_seg1.1)
EN_SEG_2: Logic (U2.12), B2/seg2 (R9_seg2.1)
EN_SEG_3: Logic (U2.13), B2/seg3 (R9_seg3.1)
EN_SEG_4: Logic (U2.14), B2/seg4 (R9_seg4.1)
EN_SEG_5: Logic (U2.7), B2/seg5 (R9_seg5.1)
EN_SEG_6: Logic (U2.6), B2/seg6 (R9_seg6.1)
EN_SEG_7: Logic (U2.5), B2/seg7 (R9_seg7.1)
EN_SEG_DP1: Logic (U2.4), Dots (R15.1)
EN_SEG_DP2: Logic (U4.11), B4/seg9 (R9_seg9.1)
K11: Drivers (SEG-A.K3), B2/seg1 (R1_seg1.2)
K12: Drivers (SEG-B.K1), B2/seg2 (R1_seg2.2)
K13: Drivers (SEG-C.K1), B2/seg3 (R1_seg3.2)
K14: Drivers (SEG-D.K3), B2/seg4 (R1_seg4.2)
K15: Drivers (SEG-E.K1), B2/seg5 (R1_seg5.2)
K16: Drivers (SEG-F.K1), B2/seg6 (R1_seg6.2)
K17: Drivers (SEG-G.K3), B2/seg7 (R1_seg7.2)
K21: Drivers (SEG-A.K2), B2/seg1 (T2_seg1.2)
K22: Drivers (SEG-B.K2), B2/seg2 (T2_seg2.2)
K23: Drivers (SEG-C.K2), B2/seg3 (T2_seg3.2)
K24: Drivers (SEG-D.K2), B2/seg4 (T2_seg4.2)
K25: Drivers (SEG-E.K2), B2/seg5 (T2_seg5.2)
K26: Drivers (SEG-F.K2), B2/seg6 (T2_seg6.2)
K27: Drivers (SEG-G.K2), B2/seg7 (T2_seg7.2)
K31: Drivers (SEG-A.K1), B2/seg1 (R2_seg1.2)
K32: Drivers (SEG-B.K3), B2/seg2 (R2_seg2.2)
K33: Drivers (SEG-C.K3), B2/seg3 (R2_seg3.2)
K34: Drivers (SEG-D.K1), B2/seg4 (R2_seg4.2)
K35: Drivers (SEG-E.K3), B2/seg5 (R2_seg5.2)
K36: Drivers (SEG-F.K3), B2/seg6 (R2_seg6.2)
K37: Drivers (SEG-G.K1), B2/seg7 (R2_seg7.2)
LAT: Input (R31.2 Z1.3), Logic (U2.1 U4.1), Output (U1.12 U1.13)
MODE: Input (R30.2 Z1.1), Logic (U2.15 U4.15), Output (U1.9 U1.10), DAC (U3.2 U3.5 U3.10 U3.13)
NetD2_seg9_3: Dots (R15.2), B4/seg9 (D2_seg9.3)
NetR1_seg9_2: Dots (R16.1), B4/seg9 (R1_seg9.2)
NetR2_seg9_2: Dots (R10.1), B4/seg9 (R2_seg9.2)
NetR12_1: Dots (R12.1), B4/seg9 (T2_seg9.2)
VR: DAC (R24.1 R25.2 R26.1), B4/seg9 (U1_seg9.3)
VREF-: Dots (R27.1 R29.2), B4/seg9 (U1_seg9.2)